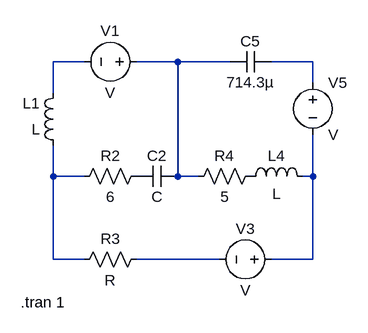
[diagram p0: schematic Draft1.asc]
Draft1.asc, the LTspice schematic file:
Version 4
SHEET 1 880 680
WIRE 112 64 64 64
WIRE 256 64 192 64
WIRE 336 64 256 64
WIRE 464 64 400 64
WIRE 464 96 464 64
WIRE 64 112 64 64
WIRE 64 240 64 192
WIRE 112 240 64 240
WIRE 256 240 256 64
WIRE 288 240 256 240
WIRE 464 240 464 176
WIRE 464 240 448 240
WIRE 64 368 64 240
WIRE 112 368 64 368
WIRE 320 368 192 368
WIRE 464 368 464 240
WIRE 464 368 400 368
SYMBOL voltage 208 64 R90
WINDOW 0 -32 56 VBottom 2
WINDOW 3 32 56 VTop 2
SYMATTR InstName V1
SYMBOL cap 400 48 R90
WINDOW 0 0 32 VBottom 2
WINDOW 3 32 32 VTop 2
SYMATTR InstName C5
SYMATTR Value 714.3µ
SYMBOL voltage 464 80 R0
SYMATTR InstName V5
SYMBOL ind 352 256 R270
WINDOW 0 32 56 VTop 2
WINDOW 3 5 56 VBottom 2
SYMATTR InstName L4
SYMBOL res 384 224 R90
WINDOW 0 0 56 VBottom 2
WINDOW 3 32 56 VTop 2
SYMATTR InstName R4
SYMATTR Value 5
SYMBOL cap 256 224 R90
WINDOW 0 0 32 VBottom 2
WINDOW 3 32 32 VTop 2
SYMATTR InstName C2
SYMBOL res 208 224 R90
WINDOW 0 0 56 VBottom 2
WINDOW 3 32 56 VTop 2
SYMATTR InstName R2
SYMATTR Value 6
SYMBOL ind 80 208 R180
WINDOW 0 36 80 Left 2
WINDOW 3 36 40 Left 2
SYMATTR InstName L1
SYMBOL res 208 352 R90
WINDOW 0 0 56 VBottom 2
WINDOW 3 32 56 VTop 2
SYMATTR InstName R3
SYMBOL voltage 416 368 R90
WINDOW 0 -32 56 VBottom 2
WINDOW 3 32 56 VTop 2
SYMATTR InstName V3
TEXT 14 434 Left 2 !.tran 1

The netlist it stands for:
* Draft1.asc
V1 N002 N001 V
C5 N003 N002 714.3µ
V5 N003 N005 V
L4 P001 N005 L
R4 P001 N002 5
C2 N002 P002 C
R2 P002 N004 6
L1 N004 N001 L
R3 N006 N004 R
V3 N005 N006 V
.tran 1
.backanno
.end